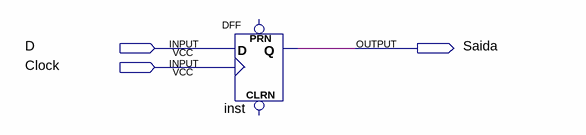
[diagram p0: schematic sheet]
// Quartus schematic testereg.bdf as structural Verilog: 1 symbols, 3 pins
module testereg (
  input  D,
  input  Clock,
  output Saida
);

  DFF inst (.CLK(Clock), .D(D), .Q(Saida));  // open: CLRN, PRN
endmodule
